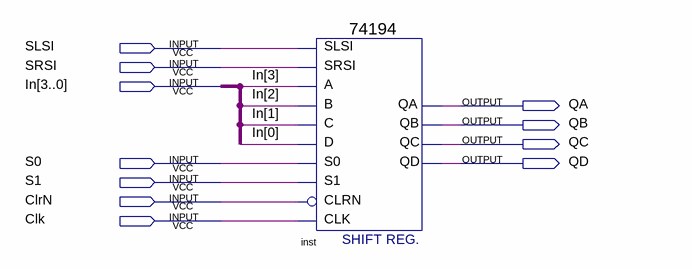
[diagram p0: schematic sheet]
// Quartus schematic Register_74194.bdf as structural Verilog: 1 symbols, 11 pins
module Register_74194 (
  input  SLSI,
  input  SRSI,
  input  [3:0] In,
  input  S0,
  input  S1,
  input  ClrN,
  input  Clk,
  output QA,
  output QB,
  output QC,
  output QD
);

  \74194  inst (
    .SLSI(SLSI), .SRSI(SRSI), .B(In[2]), .C(In[1]), .CLK(Clk), .CLRN(ClrN), .D(In[0]), .S1(S1), .S0(S0),
    .A(In[3]), .QA(QA), .QB(QB), .QC(QC), .QD(QD));
endmodule
